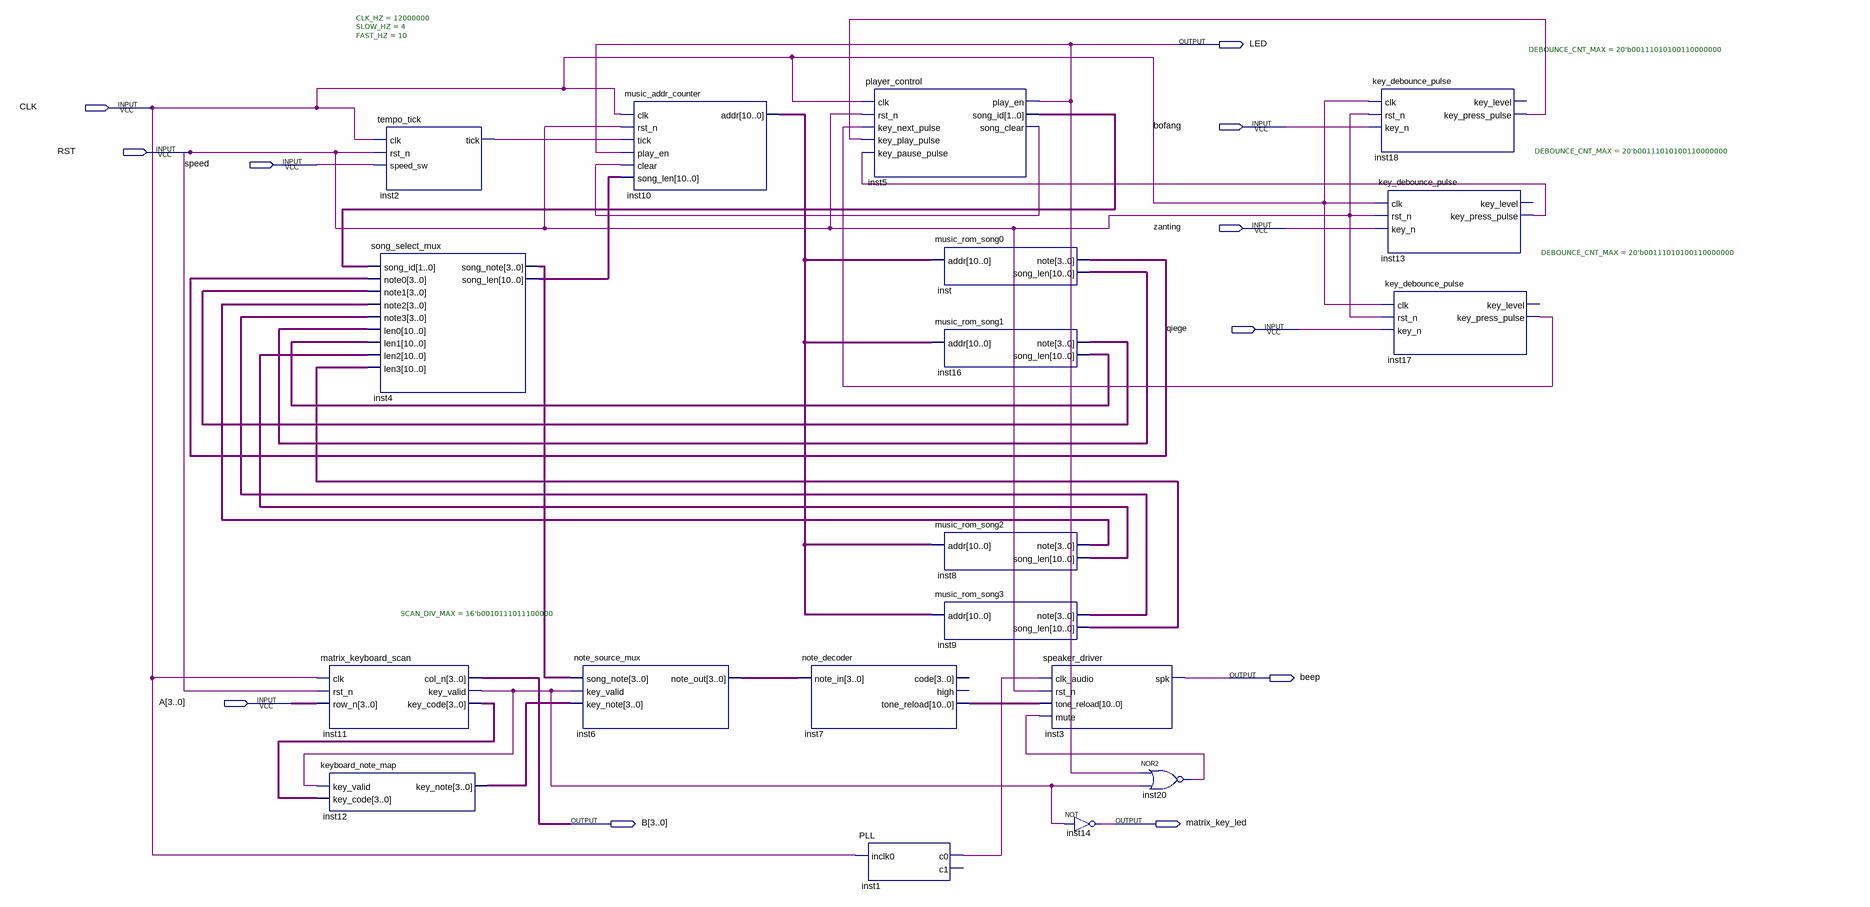
[diagram p0: schematic sheet]
// Quartus schematic piano2.bdf as structural Verilog: 19 symbols, 11 pins
module piano2 (
  input  CLK,
  input  bofang,
  input  RST,
  input  speed,
  input  zanting,
  input  qiege,
  input  [3:0] A,
  output LED,
  output beep,
  output [3:0] B,
  output matrix_key_led
);

  wire inst1_c0, inst2_tick, inst5_song_clear, inst11_key_valid, inst13_key_press_pulse,
       inst17_key_press_pulse, inst18_key_press_pulse, inst20_out;
  wire [1:0] inst5_song_id;
  wire [3:0] inst4_song_note, inst6_note_out, inst8_note, inst9_note, inst11_key_code, inst12_key_note,
       inst16_note, inst_note;
  wire [10:0] inst4_song_len, inst7_tone_reload, inst8_song_len, inst9_song_len, inst10_addr,
       inst16_song_len, inst_song_len;

  matrix_keyboard_scan #(.SCAN_DIV_MAX(16'b0010111011100000)) inst11 (
    .clk(CLK), .rst_n(RST), .row_n(A), .col_n(B), .key_valid(inst11_key_valid), .key_code(inst11_key_code));
  keyboard_note_map inst12 (.key_valid(inst11_key_valid), .key_code(inst11_key_code), .key_note(inst12_key_note));
  tempo_tick #(.CLK_HZ(12000000), .SLOW_HZ(4), .FAST_HZ(10)) inst2 (
    .clk(CLK), .rst_n(RST), .speed_sw(speed), .tick(inst2_tick));
  song_select_mux inst4 (
    .song_id(inst5_song_id), .note0(inst_note), .note1(inst16_note), .note2(inst8_note), .note3(inst9_note),
    .len0(inst_song_len), .len1(inst16_song_len), .len2(inst8_song_len), .len3(inst9_song_len),
    .song_note(inst4_song_note), .song_len(inst4_song_len));
  note_source_mux inst6 (
    .song_note(inst4_song_note), .key_valid(inst11_key_valid), .key_note(inst12_key_note),
    .note_out(inst6_note_out));
  music_addr_counter inst10 (
    .clk(CLK), .rst_n(RST), .tick(inst2_tick), .play_en(LED), .clear(inst5_song_clear),
    .song_len(inst4_song_len), .addr(inst10_addr));
  note_decoder inst7 (.note_in(inst6_note_out), .tone_reload(inst7_tone_reload));  // open: code, high
  player_control inst5 (
    .clk(CLK), .rst_n(RST), .key_next_pulse(inst17_key_press_pulse), .key_play_pulse(inst18_key_press_pulse),
    .key_pause_pulse(inst13_key_press_pulse), .play_en(LED), .song_id(inst5_song_id),
    .song_clear(inst5_song_clear));
  PLL inst1 (.inclk0(CLK), .c0(inst1_c0));  // open: c1
  music_rom_song0 inst (.addr(inst10_addr), .note(inst_note), .song_len(inst_song_len));
  music_rom_song1 inst16 (.addr(inst10_addr), .note(inst16_note), .song_len(inst16_song_len));
  music_rom_song2 inst8 (.addr(inst10_addr), .note(inst8_note), .song_len(inst8_song_len));
  music_rom_song3 inst9 (.addr(inst10_addr), .note(inst9_note), .song_len(inst9_song_len));
  speaker_driver inst3 (
    .clk_audio(inst1_c0), .rst_n(RST), .tone_reload(inst7_tone_reload), .mute(inst20_out), .spk(beep));
  not inst14 (matrix_key_led, inst11_key_valid);
  nor inst20 (inst20_out, LED, inst11_key_valid);
  key_debounce_pulse #(.DEBOUNCE_CNT_MAX(20'b00111010100110000000)) inst18 (
    .clk(CLK), .rst_n(RST), .key_n(bofang), .key_press_pulse(inst18_key_press_pulse));  // open: key_level
  key_debounce_pulse #(.DEBOUNCE_CNT_MAX(20'b00111010100110000000)) inst13 (
    .clk(CLK), .rst_n(RST), .key_n(zanting), .key_press_pulse(inst13_key_press_pulse));  // open: key_level
  key_debounce_pulse #(.DEBOUNCE_CNT_MAX(20'b00111010100110000000)) inst17 (
    .clk(CLK), .rst_n(RST), .key_n(qiege), .key_press_pulse(inst17_key_press_pulse));  // open: key_level
endmodule
